# EAGLE schematic Microcontroller Board 1.6 (EAGLE 7.1.0)
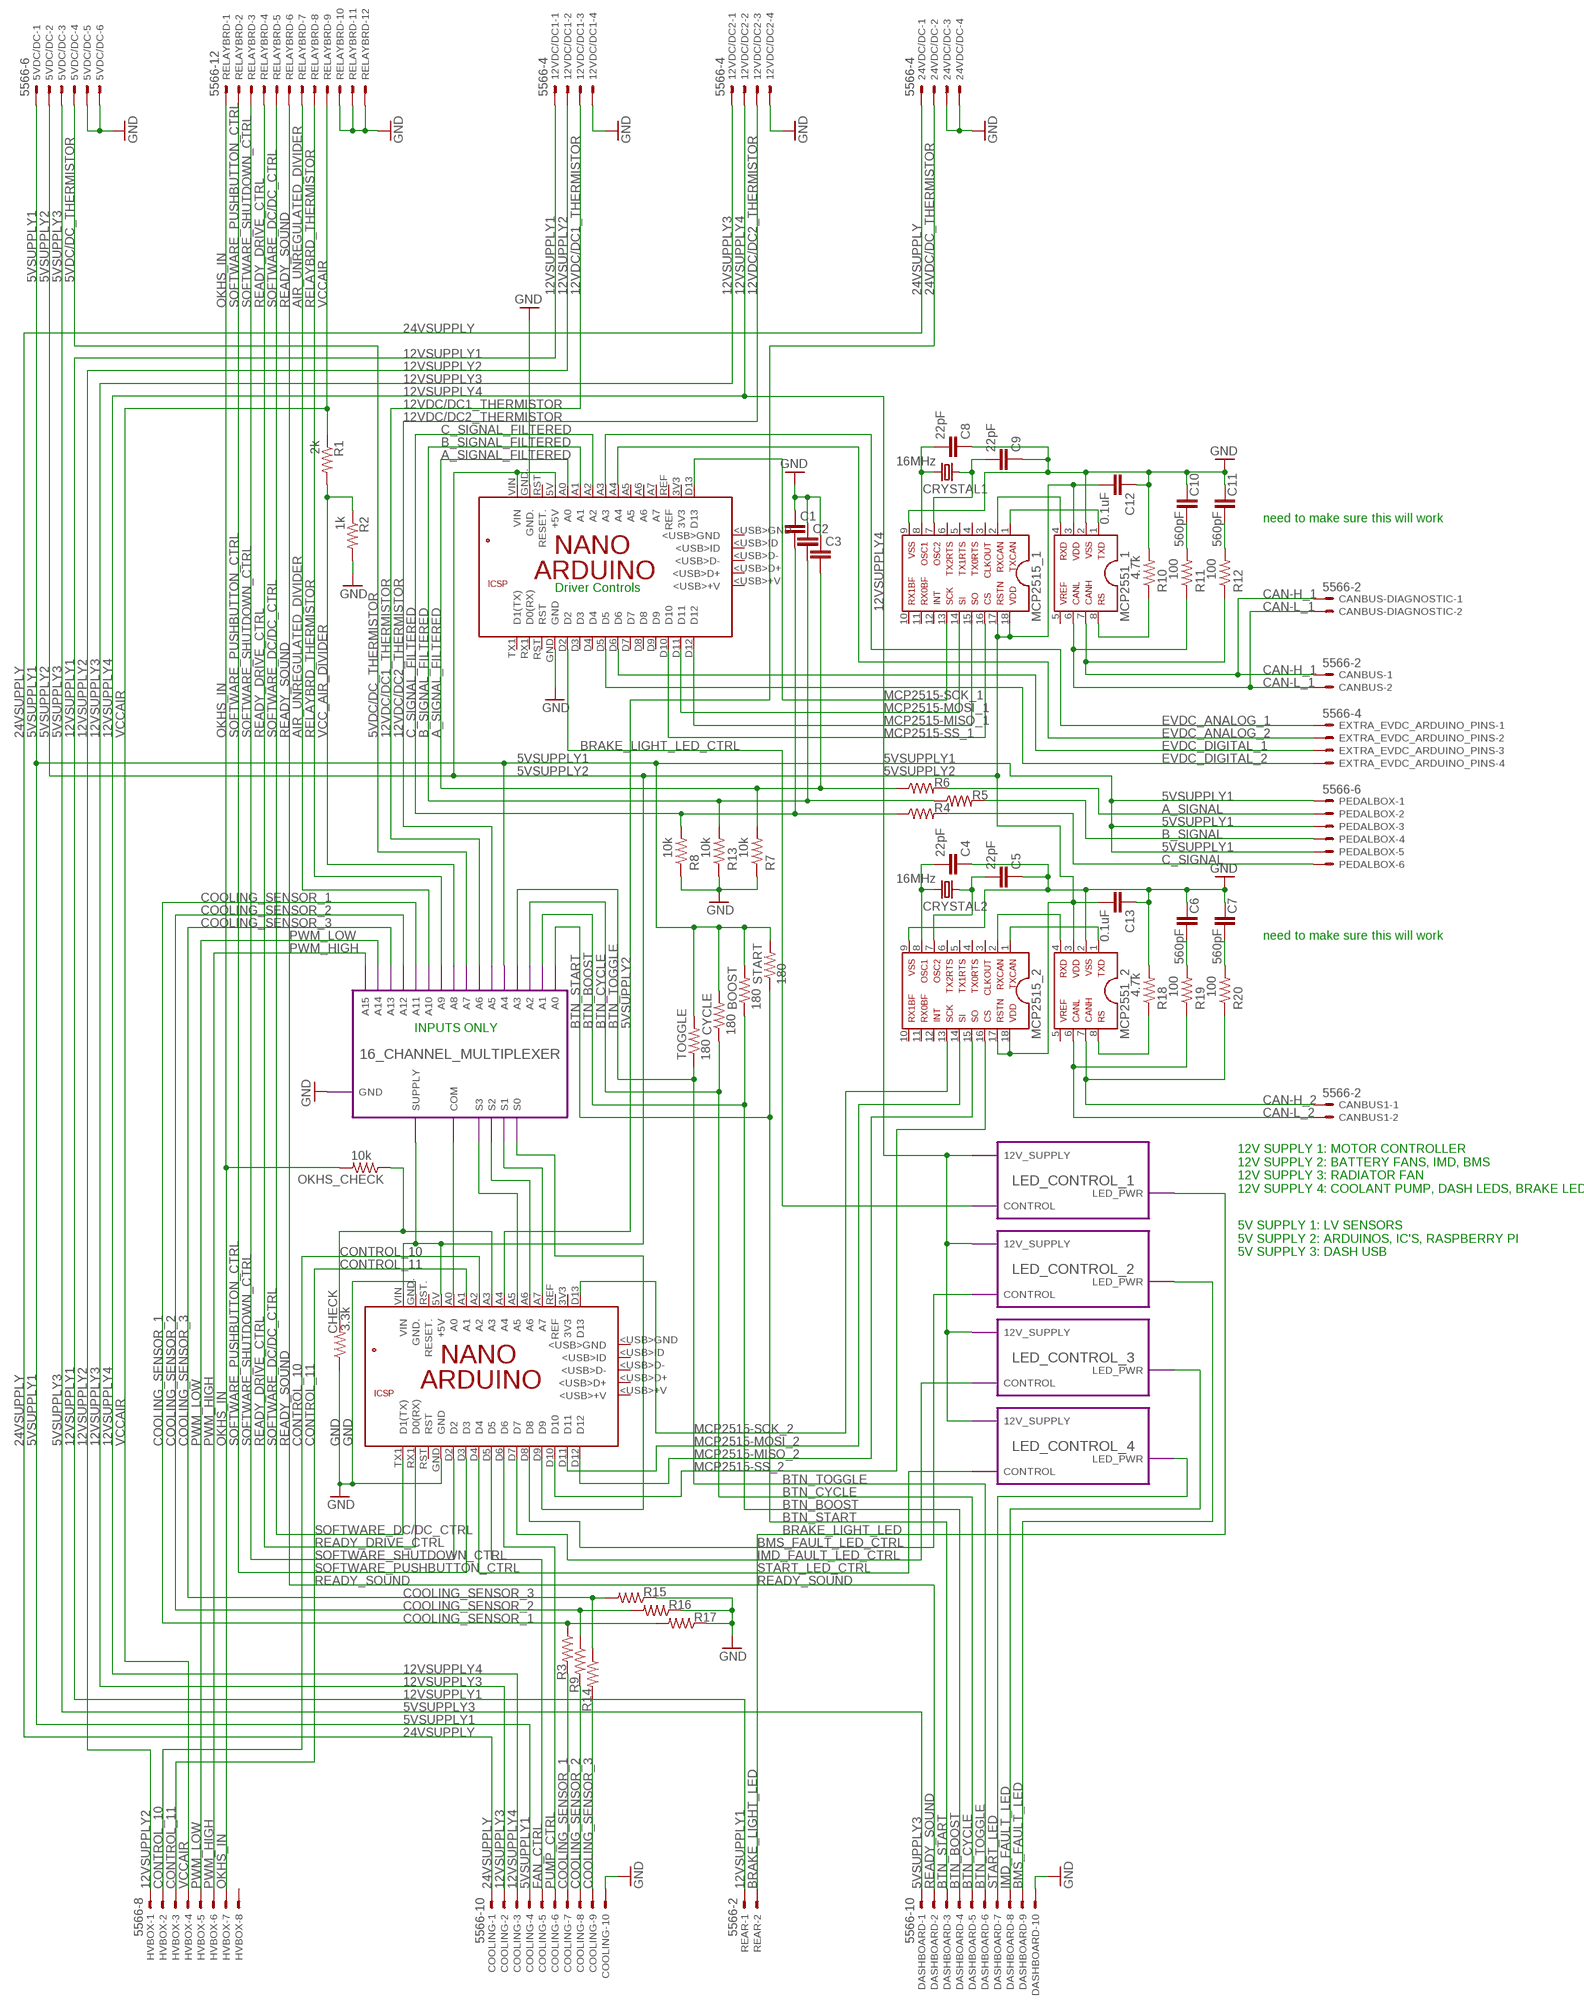
[diagram p0: schematic, sheet 1]

## Parts
5VDC/DC  5566-6  [5566-6]
12VDC/DC1  5566-4  [5566-4]
12VDC/DC2  5566-4  [5566-4]
24VDC/DC  5566-4  [5566-4]
BOOST  180  RESISTORPTH-1/4W  [AXIAL-0.4]
C1  CAPPTH  [CAP-PTH-SMALL]
C2  CAPPTH  [CAP-PTH-SMALL]
C3  CAPPTH  [CAP-PTH-SMALL]
C4  22pF  CAPPTH  [CAP-PTH-SMALL]
C5  22pF  CAPPTH  [CAP-PTH-SMALL]
C6  560pF  CAPPTH  [CAP-PTH-SMALL]
C7  560pF  CAPPTH  [CAP-PTH-SMALL]
C8  22pF  CAPPTH  [CAP-PTH-SMALL]
C9  22pF  CAPPTH  [CAP-PTH-SMALL]
C10  560pF  CAPPTH  [CAP-PTH-SMALL]
C11  560pF  CAPPTH  [CAP-PTH-SMALL]
C12  0.1uF  CAPPTH  [CAP-PTH-SMALL]
C13  0.1uF  CAPPTH  [CAP-PTH-SMALL]
CANBUS  5566-2  [5566-2]
CANBUS1  5566-2  [5566-2]
CANBUS-DIAGNOSTIC  5566-2  [5566-2]
CHECK  3.3k  RESISTORPTH-1/4W  [AXIAL-0.4]
COOLING  5566-10  [5566-10]
CRYSTAL1  16MHz  CRYSTALHC49US  [HC49US]
CRYSTAL2  16MHz  CRYSTALHC49US  [HC49US]
CYCLE  180  RESISTORPTH-1/4W  [AXIAL-0.4]
DASHBOARD  5566-10  [5566-10]
EXTRA_EVDC_ARDUINO_PINS  5566-4  [5566-4]
HVBOX  5566-8  [5566-8]
MCP2515_1  MCP2515  [DIL18]
MCP2515_2  MCP2515  [DIL18]
MCP2551_1  MCP2551  [DIL08]
MCP2551_2  MCP2551  [DIL08]
OKHS_CHECK  10k  RESISTORPTH-1/4W  [AXIAL-0.4]
PCB1  ARDUINO_NANO  [ARDUINO_NANO]
PCB2  ARDUINO_NANO  [ARDUINO_NANO]
PEDALBOX  5566-6  [5566-6]
R1  2k  RESISTORPTH-1/4W  [AXIAL-0.4]
R2  1k  RESISTORPTH-1/4W  [AXIAL-0.4]
R3  RESISTORPTH-1/4W  [AXIAL-0.4]
R4  RESISTORPTH-1/4W  [AXIAL-0.4]
R5  RESISTORPTH-1/4W  [AXIAL-0.4]
R6  RESISTORPTH-1/4W  [AXIAL-0.4]
R7  10k  RESISTORPTH-1/4W  [AXIAL-0.4]
R8  10k  RESISTORPTH-1/4W  [AXIAL-0.4]
R9  RESISTORPTH-1/4W  [AXIAL-0.4]
R10  4.7k  RESISTORPTH-1/4W  [AXIAL-0.4]
R11  100  RESISTORPTH-1/4W  [AXIAL-0.4]
R12  100  RESISTORPTH-1/4W  [AXIAL-0.4]
R13  10k  RESISTORPTH-1/4W  [AXIAL-0.4]
R14  RESISTORPTH-1/4W  [AXIAL-0.4]
R15  RESISTORPTH-1/4W  [AXIAL-0.4]
R16  RESISTORPTH-1/4W  [AXIAL-0.4]
R17  RESISTORPTH-1/4W  [AXIAL-0.4]
R18  4.7k  RESISTORPTH-1/4W  [AXIAL-0.4]
R19  100  RESISTORPTH-1/4W  [AXIAL-0.4]
R20  100  RESISTORPTH-1/4W  [AXIAL-0.4]
REAR  5566-2  [5566-2]
RELAYBRD  5566-12  [5566-12]
START  180  RESISTORPTH-1/4W  [AXIAL-0.4]
TOGGLE  180  RESISTORPTH-1/4W  [AXIAL-0.4]

## Module instances
LED_CONTROL_1 = TRANSISTOR_CONTROL_MODULE
LED_CONTROL_2 = TRANSISTOR_CONTROL_MODULE
LED_CONTROL_3 = TRANSISTOR_CONTROL_MODULE
LED_CONTROL_4 = TRANSISTOR_CONTROL_MODULE
16_CHANNEL_MULTIPLEXER = 16_CHANNEL_MULTIPLEXER

## Nets
5VDC/DC_THERMISTOR: 5VDC/DC.4 ; port 16_CHANNEL_MULTIPLEXER.A7
5VSUPPLY1: 5VDC/DC.1 BOOST.P$2 COOLING.4 CYCLE.P$2 PEDALBOX.1 PEDALBOX.3 PEDALBOX.5 START.P$2 TOGGLE.P$2 ; port 16_CHANNEL_MULTIPLEXER.A4
5VSUPPLY2: 5VDC/DC.2 C12.2 C13.2 MCP2515_1.17 MCP2515_1.18 MCP2515_2.17 MCP2515_2.18 MCP2551_1.3 MCP2551_2.3 PCB1.5V(+5V) PCB1.VIN PCB2.5V(+5V) PCB2.VIN ; port 16_CHANNEL_MULTIPLEXER.SUPPLY
5VSUPPLY3: 5VDC/DC.3 DASHBOARD.1
12VDC/DC1_THERMISTOR: 12VDC/DC1.3 ; port 16_CHANNEL_MULTIPLEXER.A6
12VDC/DC2_THERMISTOR: 12VDC/DC2.3 ; port 16_CHANNEL_MULTIPLEXER.A5
12VSUPPLY1: 12VDC/DC1.1 REAR.1
12VSUPPLY2: 12VDC/DC1.2 HVBOX.1
12VSUPPLY3: 12VDC/DC2.1 COOLING.2
12VSUPPLY4: 12VDC/DC2.2 COOLING.3 ; port LED_CONTROL_3.12V_SUPPLY LED_CONTROL_1.12V_SUPPLY LED_CONTROL_2.12V_SUPPLY LED_CONTROL_4.12V_SUPPLY
24VDC/DC_THERMISTOR: 24VDC/DC.2 PCB1.A4
24VSUPPLY: 24VDC/DC.1 COOLING.1
A_SIGNAL: PEDALBOX.2 R6.P$2
A_SIGNAL_FILTERED: C3.2 PCB2.A0 R6.P$1 R7.P$2
AIR_UNREGULATED_DIVIDER: RELAYBRD.7 ; port 16_CHANNEL_MULTIPLEXER.A10
B_SIGNAL: PEDALBOX.4 R5.P$2
B_SIGNAL_FILTERED: C2.2 PCB2.A1 R5.P$1 R13.P$2
BMS_FAULT_LED: DASHBOARD.9 ; port LED_CONTROL_2.LED_PWR
BMS_FAULT_LED_CTRL: PCB1.D8 ; port LED_CONTROL_2.CONTROL
BRAKE_LIGHT_LED: REAR.2 ; port LED_CONTROL_1.LED_PWR
BRAKE_LIGHT_LED_CTRL: PCB2.D2 ; port LED_CONTROL_1.CONTROL
BTN_BOOST: BOOST.P$1 DASHBOARD.4 ; port 16_CHANNEL_MULTIPLEXER.A1
BTN_CYCLE: CYCLE.P$1 DASHBOARD.5 ; port 16_CHANNEL_MULTIPLEXER.A2
BTN_START: DASHBOARD.3 START.P$1 ; port 16_CHANNEL_MULTIPLEXER.A0
BTN_TOGGLE: DASHBOARD.6 TOGGLE.P$1 ; port 16_CHANNEL_MULTIPLEXER.A3
C_SIGNAL: PEDALBOX.6 R4.P$2
C_SIGNAL_FILTERED: C1.2 PCB2.A2 R4.P$1 R8.P$2
CAN-H_1: CANBUS-DIAGNOSTIC.1 CANBUS.1 MCP2551_1.7 R12.P$1
CAN-H_2: CANBUS1.1 MCP2551_2.7 R20.P$1
CAN-L_1: CANBUS-DIAGNOSTIC.2 CANBUS.2 MCP2551_1.6 R11.P$1
CAN-L_2: CANBUS1.2 MCP2551_2.6 R19.P$1
CONTROL_10: HVBOX.2 PCB1.A2
CONTROL_11: HVBOX.3 PCB1.A1
COOLING_SENSOR_1: R3.P$1 R17.P$2 ; port 16_CHANNEL_MULTIPLEXER.A11
COOLING_SENSOR_2: R9.P$1 R16.P$2 ; port 16_CHANNEL_MULTIPLEXER.A12
COOLING_SENSOR_3: R14.P$1 R15.P$2 ; port 16_CHANNEL_MULTIPLEXER.A13
EVDC_ANALOG_1: EXTRA_EVDC_ARDUINO_PINS.1 PCB2.A3
EVDC_ANALOG_2: EXTRA_EVDC_ARDUINO_PINS.2 PCB2.A4
EVDC_DIGITAL_1: EXTRA_EVDC_ARDUINO_PINS.3 PCB2.D6
EVDC_DIGITAL_2: EXTRA_EVDC_ARDUINO_PINS.4 PCB2.D5
FAN_CTRL: COOLING.5 PCB1.D5
GND: 5VDC/DC.5 5VDC/DC.6 12VDC/DC1.4 12VDC/DC2.4 24VDC/DC.3 24VDC/DC.4 C1.1 C2.1 C3.1 C4.1 C5.1 C6.1 C7.1 C8.1 C9.1 C10.1 C11.1 C12.1 C13.1 CHECK.P$1 COOLING.10 DASHBOARD.10 MCP2515_1.9 MCP2515_2.9 MCP2551_1.2 MCP2551_2.2 PCB1.GND PCB1.GND. PCB2.GND PCB2.GND. R2.P$2 R7.P$1 R8.P$1 R10.P$2 R13.P$1 R15.P$1 R16.P$1 R17.P$1 R18.P$2 RELAYBRD.10 RELAYBRD.11 RELAYBRD.12 ; port 16_CHANNEL_MULTIPLEXER.GND
IMD_FAULT_LED: DASHBOARD.8 ; port LED_CONTROL_3.LED_PWR
IMD_FAULT_LED_CTRL: PCB1.D7 ; port LED_CONTROL_3.CONTROL
MCP2515-MISO_1: MCP2515_1.15 PCB2.D12
MCP2515-MISO_2: MCP2515_2.15 PCB1.D12
MCP2515-MOSI_1: MCP2515_1.14 PCB2.D11
MCP2515-MOSI_2: MCP2515_2.14 PCB1.D11
MCP2515-SCK_1: MCP2515_1.13 PCB2.D13
MCP2515-SCK_2: MCP2515_2.13 PCB1.D13
MCP2515-SS_1: MCP2515_1.16 PCB2.D10
MCP2515-SS_2: MCP2515_2.16 PCB1.D10
N$1: PCB1.A0 ; port 16_CHANNEL_MULTIPLEXER.COM
N$2: COOLING.7 R3.P$2
N$3: COOLING.8 R9.P$2
N$4: COOLING.9 R14.P$2
N$5: MCP2515_2.1 MCP2551_2.1
N$6: MCP2515_2.2 MCP2551_2.4
N$7: C4.2 CRYSTAL2.2 MCP2515_2.8
N$8: PCB1.A5 ; port 16_CHANNEL_MULTIPLEXER.S3
N$9: PCB1.D9 ; port 16_CHANNEL_MULTIPLEXER.S0
N$10: C8.2 CRYSTAL1.2 MCP2515_1.8
N$12: MCP2515_1.1 MCP2551_1.1
N$13: MCP2515_1.2 MCP2551_1.4
N$14: C11.2 R12.P$2
N$15: C9.2 CRYSTAL1.1 MCP2515_1.7
N$16: MCP2551_1.8 R10.P$1
N$17: C10.2 R11.P$2
N$19: CHECK.P$2 OKHS_CHECK.P$1 PCB1.A3
N$20: MCP2551_2.8 R18.P$1
N$21: C5.2 CRYSTAL2.1 MCP2515_2.7
N$22: C7.2 R20.P$2
N$23: C6.2 R19.P$2
N$24: PCB1.A6 ; port 16_CHANNEL_MULTIPLEXER.S2
N$25: PCB1.A7 ; port 16_CHANNEL_MULTIPLEXER.S1
OKHS_IN: HVBOX.7 OKHS_CHECK.P$2 RELAYBRD.1
PUMP_CTRL: COOLING.6 PCB1.D6
PWM_HIGH: HVBOX.6 ; port 16_CHANNEL_MULTIPLEXER.A15
PWM_LOW: HVBOX.5 ; port 16_CHANNEL_MULTIPLEXER.A14
READY_DRIVE_CTRL: PCB1.RX1(D0(RX)) RELAYBRD.4
READY_SOUND: DASHBOARD.2 RELAYBRD.6
RELAYBRD_THERMISTOR: RELAYBRD.8 ; port 16_CHANNEL_MULTIPLEXER.A9
SOFTWARE_DC/DC_CTRL: PCB1.TX1(D1(TX)) RELAYBRD.5
SOFTWARE_PUSHBUTTON_CTRL: PCB1.D3 RELAYBRD.2
SOFTWARE_SHUTDOWN_CTRL: PCB1.D2 RELAYBRD.3
START_LED: DASHBOARD.7 ; port LED_CONTROL_4.LED_PWR
START_LED_CTRL: PCB1.D4 ; port LED_CONTROL_4.CONTROL
VCC_AIR_DIVIDER: R1.P$2 R2.P$1 ; port 16_CHANNEL_MULTIPLEXER.A8
VCCAIR: HVBOX.4 R1.P$1 RELAYBRD.9
Unconnected: HVBOX.8 MCP2515_1.3 MCP2515_1.4 MCP2515_1.5 MCP2515_1.6 MCP2515_1.10 MCP2515_1.11 MCP2515_1.12 MCP2515_2.3 MCP2515_2.4 MCP2515_2.5 MCP2515_2.6 MCP2515_2.10 MCP2515_2.11 MCP2515_2.12 MCP2551_1.5 MCP2551_2.5 PCB1.3V3 PCB1.5V. PCB1.<USB>+V PCB1.<USB>D+ PCB1.<USB>D- PCB1.<USB>GND PCB1.<USB>ID PCB1.GND_ PCB1.MISO PCB1.MOSI PCB1.REF PCB1.RESET.. PCB1.RST PCB1.RST.(RESET.) PCB1.SCK PCB2.3V3 PCB2.5V. PCB2.<USB>+V PCB2.<USB>D+ PCB2.<USB>D- PCB2.<USB>GND PCB2.<USB>ID PCB2.A5 PCB2.A6 PCB2.A7 PCB2.D3 PCB2.D4 PCB2.D7 PCB2.D8 PCB2.D9 PCB2.GND_ PCB2.MISO PCB2.MOSI PCB2.REF PCB2.RESET.. PCB2.RST PCB2.RST.(RESET.) PCB2.RX1(D0(RX)) PCB2.SCK PCB2.TX1(D1(TX))

## Notes on the sheet
- need to make sure this will work
- Driver Controls
- need to make sure this will work
- INPUTS ONLY
- 12V SUPPLY 1: MOTOR CONTROLLER
  12V SUPPLY 2: BATTERY FANS, IMD, BMS
  12V SUPPLY 3: RADIATOR FAN
  12V SUPPLY 4: COOLANT PUMP, DASH LEDS, BRAKE LED
- 5V SUPPLY 1: LV SENSORS
  5V SUPPLY 2: ARDUINOS, IC'S, RASPBERRY PI
  5V SUPPLY 3: DASH USB

## Library data of the parts
5VDC/DC PEDALBOX = con-molex:5566-6: Mini FIT connector 6 pol Source: http://www.molex.com; MPN: 95566-61002; OC_FARNELL: unknown; OC_NEWARK: 22K8620
12VDC/DC1 12VDC/DC2 24VDC/DC EXTRA_EVDC_ARDUINO_PINS = con-molex:5566-4: Mini FIT connector 4 pol Source: http://www.molex.com; OC_FARNELL: unknown; OC_NEWARK: unknown
BOOST CHECK CYCLE OKHS_CHECK START TOGGLE = HyTech 2016:RESISTOR: Resistor Basic schematic elements and footprints for 0603, 1206, and PTH resistors.
C1-C13 = HyTech 2016-10-27-2015:CAP: Capacitor Standard 0603 ceramic capacitor, and 0.1" leaded capacitor.
CANBUS CANBUS1 CANBUS-DIAGNOSTIC REAR = con-molex:5566-2: Mini FIT connector 2 pol Source: http://www.molex.com; OC_FARNELL: 1822072; OC_NEWARK: unknown
COOLING DASHBOARD = con-molex:5566-10: Mini FIT connector 10 pol Source: http://www.molex.com; OC_FARNELL: unknown; OC_NEWARK: unknown
CRYSTAL1 CRYSTAL2 = SparkFun-FreqCtrl:CRYSTAL: Various standard crystals. Proven footprints.
HVBOX = con-molex:5566-8: Mini FIT connector 8 pol Source: http://www.molex.com; OC_FARNELL: unknown; OC_NEWARK: unknown
MCP2515_1 MCP2515_2 = HyTech 2016-10-27-2015:MCP2515
MCP2551_1 MCP2551_2 = HyTech 2016-10-27-2015:MCP2551
PCB1 PCB2 = E14_Arduino_revB:ARDUINO_NANO: Device for representing an Arduino Nano board with a footprint in an EAGLE design. Created by Dave Young for Element14. More EAGLE documentation at: http://www.element14.com/community/community/knode/cadsoft_eagle
R1-R3 R9 R14-R17 = HyTech 2016-2-21-2016:RESISTOR: Resistor Basic schematic elements and footprints for 0603, 1206, and PTH resistors.
R4-R8 R10-R13 R18-R20 = HyTech 2016-10-27-2015:RESISTOR: Resistor Basic schematic elements and footprints for 0603, 1206, and PTH resistors.
RELAYBRD = con-molex:5566-12: Mini FIT connector 12 pol Source: http://www.molex.com; OC_FARNELL: unknown; OC_NEWARK: unknown

## Module TRANSISTOR_CONTROL_MODULE
Ports: LED_PWR(out) 12V_SUPPLY(pwr) CONTROL(in)
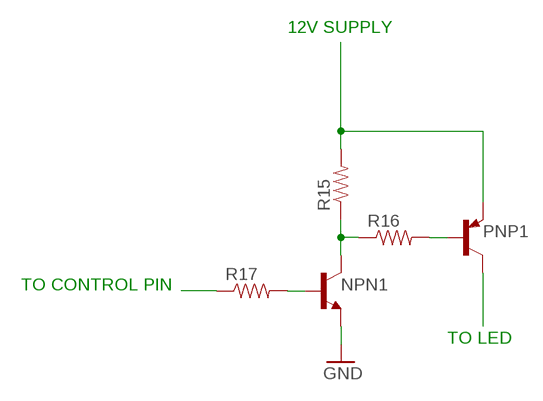
[diagram p1: schematic, module TRANSISTOR_CONTROL_MODULE, sheet 1]

### Parts
NPN1  BJT_NPNTIP120  [TO-220]
PNP1  BJT_PNP  [TO-220]
R15  RESISTORPTH-1/4W  [AXIAL-0.4]
R16  RESISTORPTH-1/4W  [AXIAL-0.4]
R17  RESISTORPTH-1/4W  [AXIAL-0.4]

### Nets
12V_SUPPLY: PNP1.3(E) R15.P$2
CONTROL: R17.P$1
GND: NPN1.3(EMITTER)
LED_PWR: PNP1.2(C)
N$24: NPN1.1(BASE) R17.P$2
N$25: NPN1.2(COLLECTOR) R15.P$1 R16.P$1
N$27: PNP1.1(B) R16.P$2

### Notes on the sheet
- 12V SUPPLY
- TO CONTROL PIN
- TO LED

### Library data of the parts
NPN1 = HyTech 2016-2-27-2016:BJT_NPN: Generic NPN BJT MMBT2222A - TRANS-08049 (SOT-23, 1A 40V) MPSA42 - TRANS-09116 (SOT-23, 500mA 300V) MMBT5088LT1G - TRANS-11160 (SOT-23, 50 mA 30V) BC547 - COM-08928 <http://www.sparkfun.com/products/8928> (TO-92 45V 100mA) (1.Collector 2.Base 3.Emitter) 2N3904 - COM-00521 <http://www.sparkfun.com/products/521> (TO-92 40V 200mA) (1.Emitter 2.Base 3.Collector) P2N2222A - COM-12852 <http://www.sparkfun.com/products/12852> (TO-92 40V 600mA) (1.Collector 2.Base 3.Emitter)
PNP1 = HyTech 2016-2-27-2016:BJT_PNP
R15-R17 = HyTech 2016-11-02-2015-6-51pm:RESISTOR: Resistor Basic schematic elements and footprints for 0603, 1206, and PTH resistors.

## Module 16_CHANNEL_MULTIPLEXER
Ports: S0(in) S1(in) S2(in) S3(in) SUPPLY(pwr) COM(out) A0(in) A1(in) A2(in) A3(in) A4(in) A5(in) A6(in) A7(in) A8(in) A9(in) A10(in) A11(in) A12(in) A13(in) A14(in) A15(in) GND(pwr)
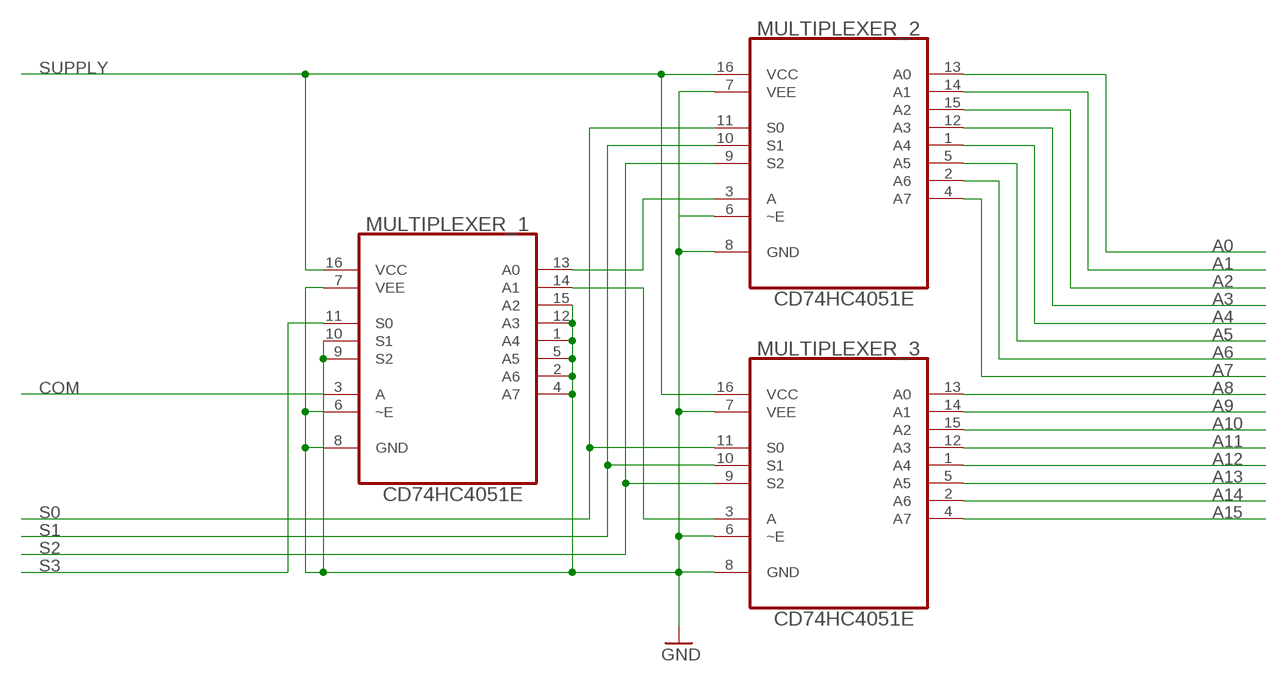
[diagram p2: schematic, module 16_CHANNEL_MULTIPLEXER, sheet 1]

### Parts
MULTIPLEXER_1  CD74HC4051E  [DIL16]
MULTIPLEXER_2  CD74HC4051E  [DIL16]
MULTIPLEXER_3  CD74HC4051E  [DIL16]

### Nets
A0: MULTIPLEXER_2.13(A0)
A1: MULTIPLEXER_2.14(A1)
A2: MULTIPLEXER_2.15(A2)
A3: MULTIPLEXER_2.12(A3)
A4: MULTIPLEXER_2.1(A4)
A5: MULTIPLEXER_2.5(A5)
A6: MULTIPLEXER_2.2(A6)
A7: MULTIPLEXER_2.4(A7)
A8: MULTIPLEXER_3.13(A0)
A9: MULTIPLEXER_3.14(A1)
A10: MULTIPLEXER_3.15(A2)
A11: MULTIPLEXER_3.12(A3)
A12: MULTIPLEXER_3.1(A4)
A13: MULTIPLEXER_3.5(A5)
A14: MULTIPLEXER_3.2(A6)
A15: MULTIPLEXER_3.4(A7)
COM: MULTIPLEXER_1.3(A)
GND: MULTIPLEXER_1.1(A4) MULTIPLEXER_1.2(A6) MULTIPLEXER_1.4(A7) MULTIPLEXER_1.5(A5) MULTIPLEXER_1.6(~E) MULTIPLEXER_1.7(VEE) MULTIPLEXER_1.8(GND) MULTIPLEXER_1.9(S2) MULTIPLEXER_1.10(S1) MULTIPLEXER_1.12(A3) MULTIPLEXER_1.15(A2) MULTIPLEXER_2.6(~E) MULTIPLEXER_2.7(VEE) MULTIPLEXER_2.8(GND) MULTIPLEXER_3.6(~E) MULTIPLEXER_3.7(VEE) MULTIPLEXER_3.8(GND)
N$2: MULTIPLEXER_1.14(A1) MULTIPLEXER_3.3(A)
N$4: MULTIPLEXER_1.13(A0) MULTIPLEXER_2.3(A)
S0: MULTIPLEXER_2.11(S0) MULTIPLEXER_3.11(S0)
S1: MULTIPLEXER_2.10(S1) MULTIPLEXER_3.10(S1)
S2: MULTIPLEXER_2.9(S2) MULTIPLEXER_3.9(S2)
S3: MULTIPLEXER_1.11(S0)
SUPPLY: MULTIPLEXER_1.16(VCC) MULTIPLEXER_2.16(VCC) MULTIPLEXER_3.16(VCC)

### Library data of the parts
MULTIPLEXER_1-MULTIPLEXER_3 = HyTech 2016-2-21-2016:CD74HC4051E: Texas Instruments CD74HC4051E HIGH-SPEED CMOS LOGIC ANALOG 8 CHANNEL MULTIPLEXER/DEMULTIPLEXER